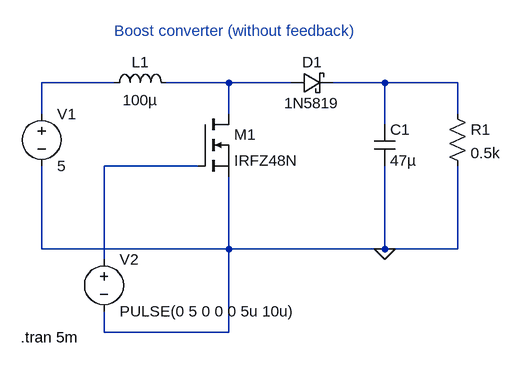
[diagram p0: schematic Boost_con_2.asc]
Boost_con_2.asc, the LTspice schematic file:
Version 4
SHEET 1 880 680
WIRE 112 80 0 80
WIRE 288 80 192 80
WIRE 384 80 288 80
WIRE 528 80 448 80
WIRE 640 80 528 80
WIRE 0 128 0 80
WIRE 288 128 288 80
WIRE 640 128 640 80
WIRE 528 144 528 80
WIRE 240 208 96 208
WIRE 0 336 0 208
WIRE 288 336 288 224
WIRE 288 336 0 336
WIRE 528 336 528 208
WIRE 528 336 288 336
WIRE 640 336 640 208
WIRE 640 336 528 336
WIRE 96 352 96 208
WIRE 96 464 96 432
WIRE 288 464 288 336
WIRE 288 464 96 464
FLAG 528 336 0
SYMBOL voltage 0 112 R0
WINDOW 123 0 0 Left 0
WINDOW 39 0 0 Left 0
SYMATTR InstName V1
SYMATTR Value 5
SYMBOL ind 96 96 R270
WINDOW 0 32 56 VTop 2
WINDOW 3 5 56 VBottom 2
SYMATTR InstName L1
SYMATTR Value 100µ
SYMBOL nmos 240 128 R0
SYMATTR InstName M1
SYMATTR Value IRFZ48N
SYMBOL schottky 384 96 R270
WINDOW 0 32 32 VTop 2
WINDOW 3 0 32 VBottom 2
SYMATTR InstName D1
SYMATTR Value 1N5819
SYMATTR Description Diode
SYMATTR Type diode
SYMBOL cap 512 144 R0
SYMATTR InstName C1
SYMATTR Value 47µ
SYMBOL res 624 112 R0
SYMATTR InstName R1
SYMATTR Value 0.5k
SYMBOL voltage 96 336 R0
WINDOW 123 0 0 Left 0
WINDOW 39 0 0 Left 0
SYMATTR InstName V2
SYMATTR Value PULSE(0 5 0 0 0 5u 10u)
TEXT -32 472 Left 2 !.tran 5m
TEXT 112 0 Left 2 ;Boost converter (without feedback)

The netlist it stands for:
* Boost_con_2.asc
V1 N001 0 5
L1 N001 N002 100µ
M1 N002 N004 0 0 IRFZ48N
D1 N002 N003 1N5819
C1 N003 0 47µ
R1 N003 0 0.5k
V2 N004 0 PULSE(0 5 0 0 0 5u 10u)
.model D D
.lib standard.dio
.model NMOS NMOS
.model PMOS PMOS
.lib standard.mos
.tran 5m
* Boost converter (without feedback)
.backanno
.end